# Altium schematic sheet SI5324_CDR_DCXO_oscillators.SchDoc: Metlino
size 420 x 297 mm; CheckedBy: P.Kulik,T.Przywozki,W.Ruclo; Author: G.Kasprowicz; CompanyName: WUT ISE; DrawnBy: G.Kasprowicz; Organization: WUT ISE; Address1: PW ISE; Address2: Nowowiejska 15/19 00-665 Warsaw; Address3: gkasprow@gmail.com; DocumentNumber: 12; Revision: 2; SheetNumber: 12; SheetTotal: 29; ModifiedBy: -; CheckedDate: -; Title2: Si5324 & DCXO clocks; DivGrp: WUT ISE; Designer: G.Kasprowicz; ModifiedDate: -; ProjectName: Sensor Box
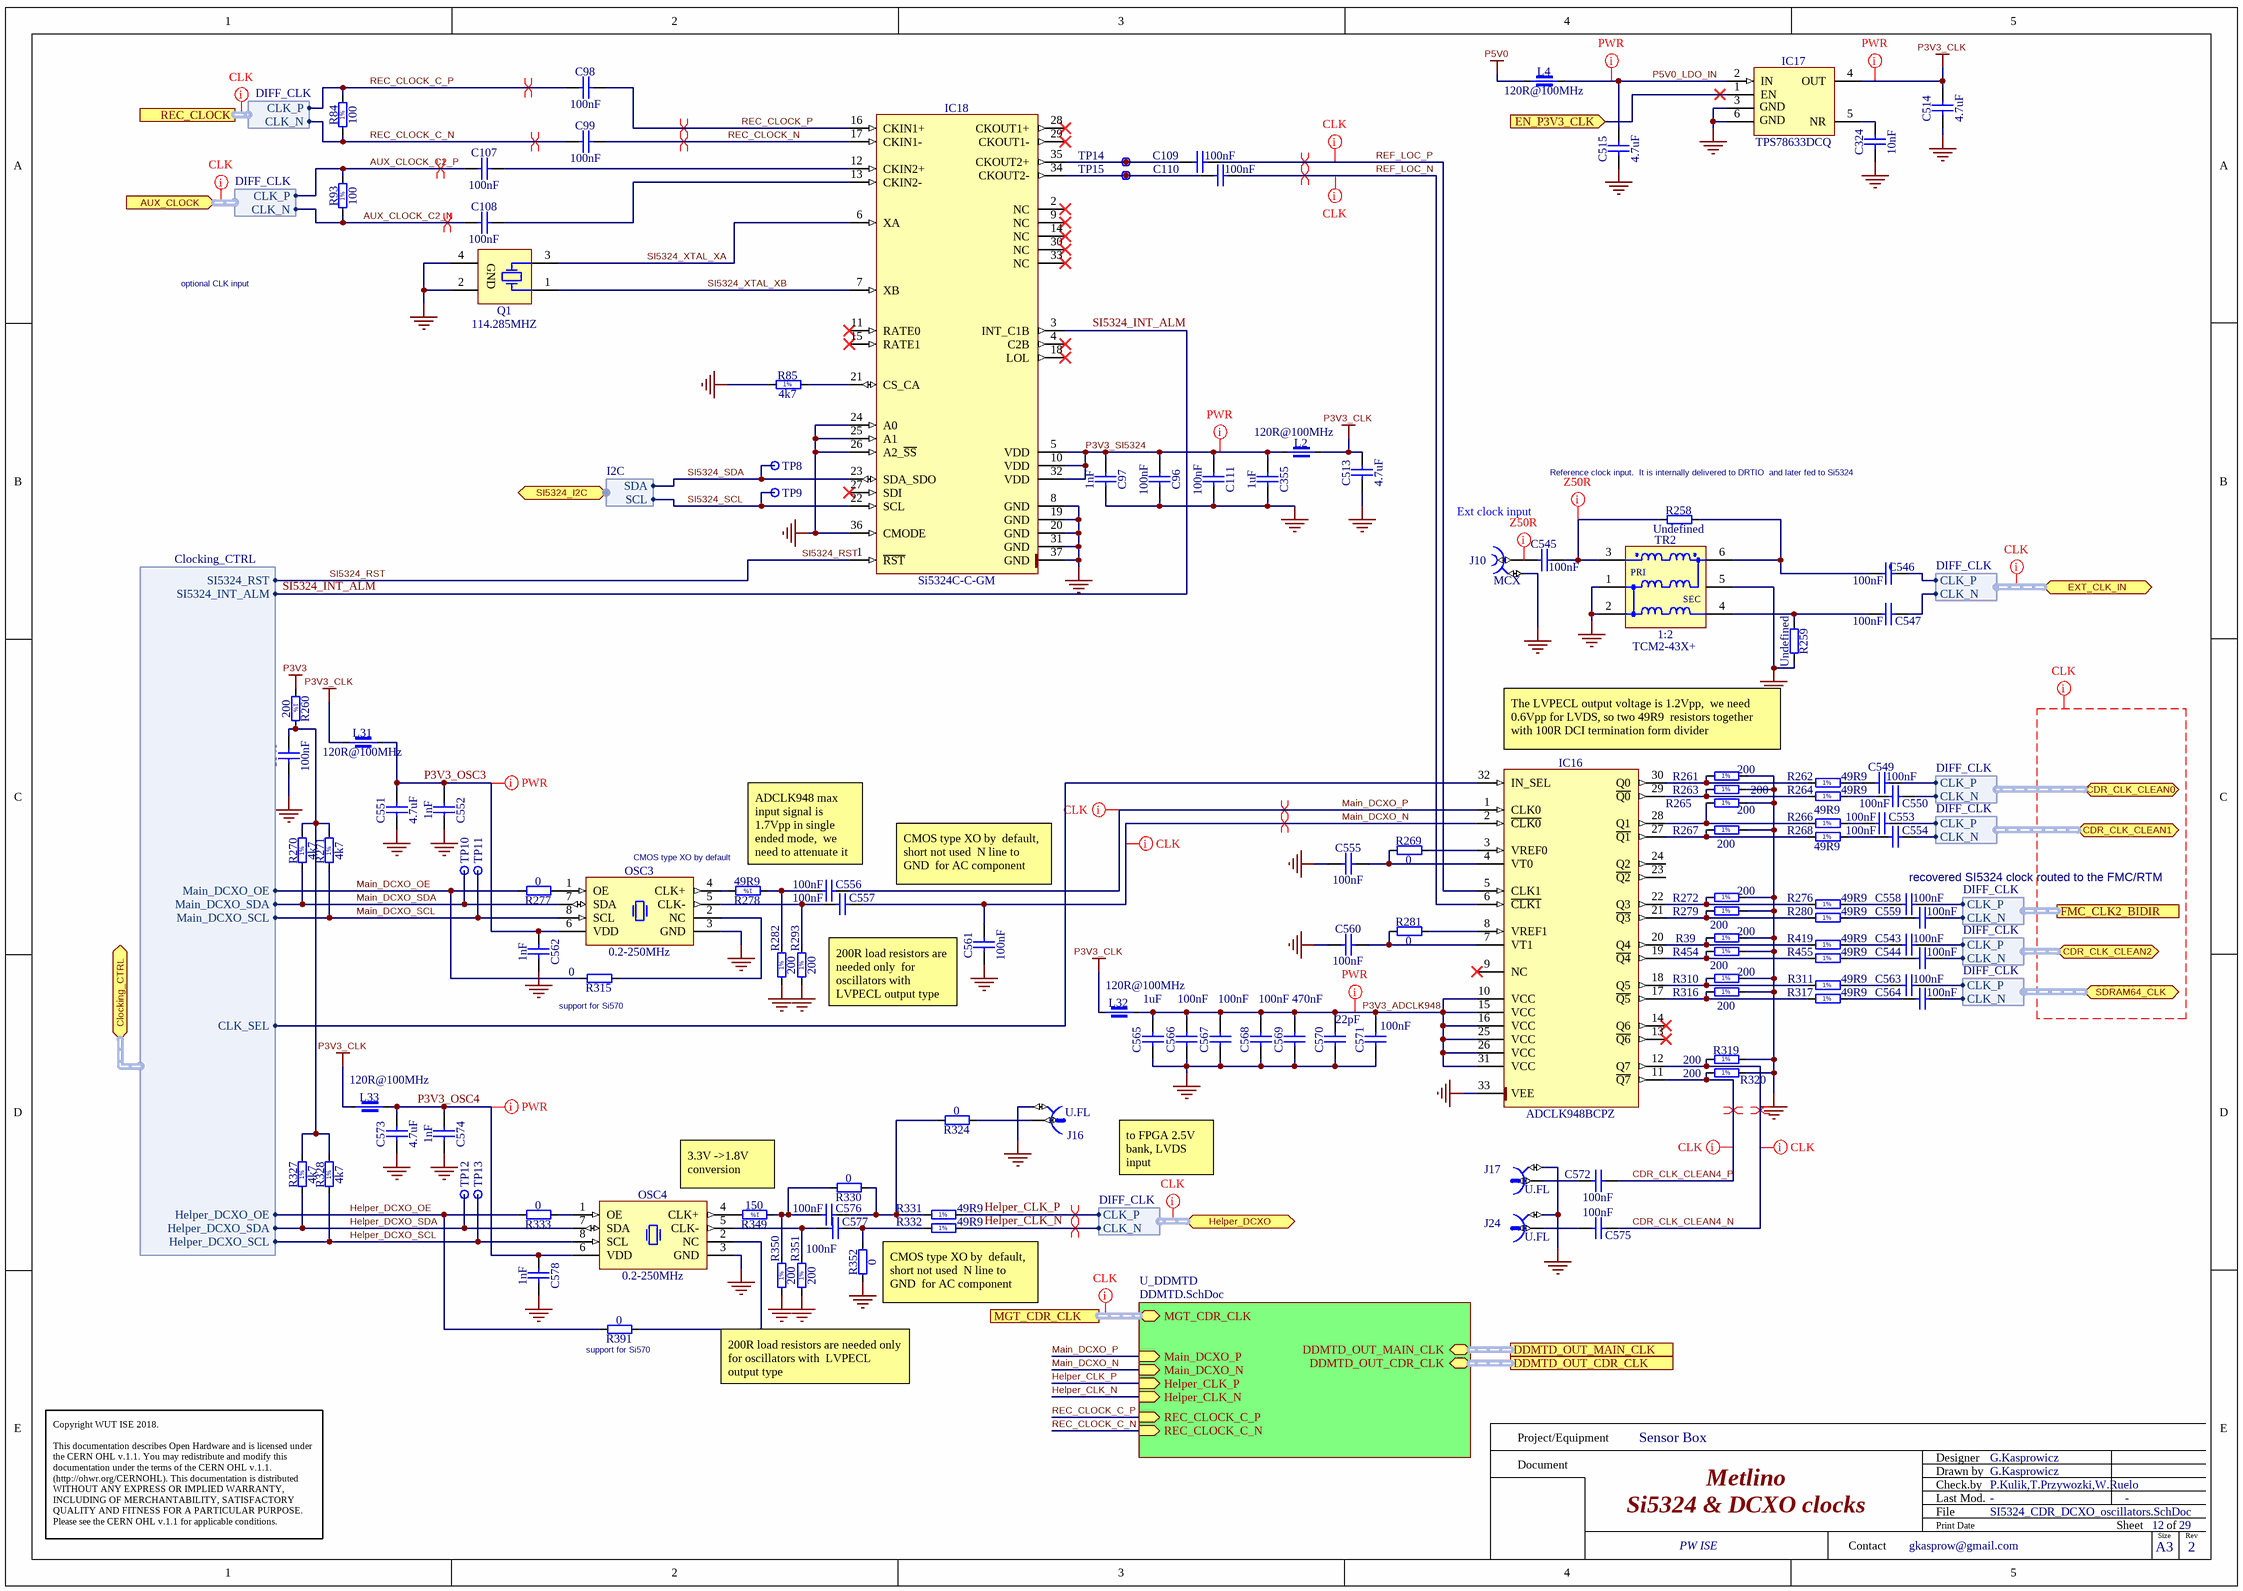
[diagram p0: SI5324_CDR_DCXO_oscillators.SchDoc]

## Parts
C96  100nF  [CAPC0603X33N]
C97  1nF  [CAPC0603X33N]
C98  100nF  [CAPC0603X33N]
C99  100nF  [CAPC0603X33N]
C107  100nF  [CAPC0603X33N]
C108  100nF  [CAPC0603X33N]
C109  100nF  [CAPC1005X55N]
C110  100nF  [CAPC1005X55N]
C111  100nF  [CAPC0603X33N]
C324  10nF  [CAPC1608X87N]
C355  1uF  [CAPC1005X55N]
C513  4.7uF  [CAPC1608X90N]
C514  4.7uF  [CAPC1608X90N]
C515  4.7uF  [CAPC1608X90N]
C543  100nF  [CAPC0603X33N]
C544  100nF  [CAPC0603X33N]
C545  100nF  [CAPC1005X55N]
C546  100nF  [CAPC1005X55N]
C547  100nF  [CAPC1005X55N]
C548  100nF  [CAPC0603X33N]
C549  100nF  [CAPC0603X33N]
C550  100nF  [CAPC0603X33N]
C551  4.7uF  [CAPC1608X90N]
C552  1nF  [CAPC0603X33N]
C553  100nF  [CAPC0603X33N]
C554  100nF  [CAPC0603X33N]
C555  100nF  [CAPC0603X33N]
C556  100nF  [CAPC1005X55N]
C557  100nF  [CAPC1005X55N]
C558  100nF  [CAPC0603X33N]
C559  100nF  [CAPC0603X33N]
C560  100nF  [CAPC0603X33N]
C561  100nF  [CAPC0603X33N]
C562  1nF  [CAPC0603X33N]
C563  100nF  [CAPC0603X33N]
C564  100nF  [CAPC0603X33N]
C565  1uF  [CAPC1005X55N]
C566  100nF  [CAPC0603X33N]
C567  100nF  [CAPC0603X33N]
C568  100nF  [CAPC0603X33N]
C569  470nF  [CAPC1005X55N]
C570  22pF  [CAPC1005X55N]
C571  100nF  [CAPC0603X33N]
C572  100nF  [CAPC0603X33N]
C573  4.7uF  [CAPC1608X90N]
C574  1nF  [CAPC0603X33N]
C575  100nF  [CAPC0603X33N]
C576  100nF  [CAPC1005X55N]
C577  100nF  [CAPC1005X55N]
C578  1nF  [CAPC0603X33N]
IC16  ADCLK948BCPZ  [QFN50P500X500X80-33N-S285]
IC17  TPS78633DCQ  [SOT127P700X180-6N]
IC18  Si5324C-C-GM  [QFN50P600X600X90-37N-S425]
J10  MCX  [AMPHENOL_ARF2521-ND]
J16  U.FL  [HIROSE_U.FL-R-SMT-1(10)]
J17  U.FL  [HIROSE_U.FL-R-SMT-1(10)]
J24  U.FL  [HIROSE_U.FL-R-SMT-1(10)]
L2  120R@100MHz  [INDC1608X95N]
L4  120R@100MHz  [INDC1608X95N]
L31  120R@100MHz  [INDC1608X95N]
L32  120R@100MHz  [INDC1608X95N]
L33  120R@100MHz  [INDC1608X95N]
OSC3  0.2-250MHz  [OSC_SILICON-LAB_SI549-A]
OSC4  0.2-250MHz  [OSC_SILICON-LAB_SI549-A]
Q1  114.285MHZ  [XTAL_CONNOR_CS]
R39  200  [RESC1005X40N]
R84  100  [RESC1005X40N]
R85  4k7  [RESC1005X40N]
R93  100  [RESC1005X40N]
R258  Undefined  [RESC1005X40N]
R259  Undefined  [RESC1005X40N]
R260  200  [RESC1005X40N]
R261  200  [RESC1005X40N]
R262  49R9  [RESC1005X40N]
R263  200  [RESC1005X40N]
R264  49R9  [RESC1005X40N]
R265  200  [RESC1005X40N]
R266  49R9  [RESC1005X40N]
R267  200  [RESC1005X40N]
R268  49R9  [RESC1005X40N]
R269  0  [RESC1005X40N]
R270  4k7  [RESC1005X40N]
R271  4k7  [RESC1005X40N]
R272  200  [RESC1005X40N]
R276  49R9  [RESC1005X40N]
R277  0  [RESC1005X40N]
R278  49R9  [RESC1005X40N]
R279  200  [RESC1005X40N]
R280  49R9  [RESC1005X40N]
R281  0  [RESC1005X40N]
R282  200  [RESC1005X40N]
R293  200  [RESC1005X40N]
R310  200  [RESC1005X40N]
R311  49R9  [RESC1005X40N]
R315  0  [RESC1005X40N]
R316  200  [RESC1005X40N]
R317  49R9  [RESC1005X40N]
R319  200  [RESC1005X40N]
R320  200  [RESC1005X40N]
R324  0  [RESC1005X40N]
R327  4k7  [RESC1005X40N]
R328  4k7  [RESC1005X40N]
R330  0  [RESC1005X40N]
R331  49R9  [RESC1005X40N]
R332  49R9  [RESC1005X40N]
R333  0  [RESC1005X40N]
R349  150  [RESC1005X40N]
R350  200  [RESC1005X40N]
R351  200  [RESC1005X40N]
R352  0  [RESC1005X40N]
R391  0  [RESC1005X40N]
R419  49R9  [RESC1005X40N]
R454  200  [RESC1005X40N]
R455  49R9  [RESC1005X40N]
TP8  Test Point  [TPS127]  (value not drawn)
TP9  Test Point  [TPS127]  (value not drawn)
TP10  Test Point  [TPS127]  (value not drawn)
TP11  Test Point  [TPS127]  (value not drawn)
TP12  Test Point  [TPS127]  (value not drawn)
TP13  Test Point  [TPS127]  (value not drawn)
TP14  Test Point  [TPS127]  (value not drawn)
TP15  Test Point  [TPS127]  (value not drawn)
TR2  1:2  Manufacturer Part Number: TCM2-43X+  [XFMR_MINI-CIRCUITS_DB1627]

## Sub-sheets
U_DDMTD = DDMTD.SchDoc: MGT_CDR_CLK (bidir, harness DIFF_CLK), DDMTD_OUT_CDR_CLK (bidir, harness DIFF_CLK), DDMTD_OUT_MAIN_CLK (bidir, harness DIFF_CLK), Main_DCXO_P (in), Main_DCXO_N (in), Helper_CLK_P (in), Helper_CLK_N (in), REC_CLOCK_C_P (in), REC_CLOCK_C_N (in)

## Ports
AUX_CLOCK (in, harness DIFF_CLK), CDR_CLK_CLEAN0 (bidir, harness DIFF_CLK), CDR_CLK_CLEAN1 (bidir, harness DIFF_CLK), CDR_CLK_CLEAN2 (bidir, harness DIFF_CLK), Clocking_CTRL (bidir, harness Clocking_CTRL), DDMTD_OUT_CDR_CLK (harness DIFF_CLK), DDMTD_OUT_MAIN_CLK (harness DIFF_CLK), EN_P3V3_CLK (in), EXT_CLK_IN (bidir, harness DIFF_CLK), FMC_CLK2_BIDIR (harness DIFF_CLK), Helper_DCXO (bidir, harness DIFF_CLK), MGT_CDR_CLK (harness DIFF_CLK), REC_CLOCK (harness DIFF_CLK), SDRAM64_CLK (bidir, harness DIFF_CLK), SI5324_I2C (bidir, harness I2C)

## Harnesses
I2C: SCL, SDA
DIFF_CLK: CLK_N, CLK_P
Clocking_CTRL: Main_DCXO_OE, Main_DCXO_SDA, Main_DCXO_SCL, Helper_DCXO_OE, Helper_DCXO_SDA, Helper_DCXO_SCL, CLK_SEL, SI5324_RST, SI5324_INT_ALM

## Nets
GND: C96.1 C97.1 C111.1 C324.1 C355.2 C513.1 C514.1 C515.1 C548.1 C551.1 C552.1 C555.1 C560.1 C561.1 C562.1 C565.2 C566.1 C567.1 C568.1 C569.1 C570.1 C571.1 C573.1 C574.1 C578.1 IC16.33(VEE) IC17.3(GND) IC17.6(GND) IC18.8(GND) IC18.19(GND) IC18.20(GND) IC18.24(A0) IC18.25(A1) IC18.26(A2_~{SS}) IC18.31(GND) IC18.36(CMODE) IC18.37(GND) J10.2 J16.2 J17.2 J24.2 OSC3.3(GND) OSC4.3(GND) Q1.2(GND) Q1.4(GND) R39.2 R85.1 R259.1 R261.2 R263.2 R265.2 R267.2 R272.2 R279.2 R282.1 R293.1 R310.2 R316.2 R319.2 R320.2 R350.1 R351.1 R352.1 R454.2 TR2.1(P1) TR2.2(P1) TR2.5(NC)
P3V3: R260.1
P3V3_CLK: C513.2 C514.2 IC17.4(OUT) L2.1 L31.1 L32.1 L33.1
P5V0: L4.1
AUX_CLOCK_C2_N: C108.2 R93.1 ; port AUX_CLOCK.CLK_N
AUX_CLOCK_C2_P: C107.2 R93.2 ; port AUX_CLOCK.CLK_P
CDR_CLK_CLEAN4_N: C575.1 IC16.12(Q7) R319.1
CDR_CLK_CLEAN4_P: C572.2 IC16.11(~{Q7}) R320.1
EN_P3V3_CLK: IC17.1(EN) ; port EN_P3V3_CLK
Helper_CLK_N: R332.2 ; sheet U_DDMTD/Helper_CLK_N, port Helper_DCXO.CLK_N
Helper_CLK_P: R331.2 ; sheet U_DDMTD/Helper_CLK_P, port Helper_DCXO.CLK_P
Helper_DCXO_OE: R333.2 R391.2 ; port Clocking_CTRL.Helper_DCXO_OE
Helper_DCXO_SCL: OSC4.8(SCL) R328.1 TP13.1 ; port Clocking_CTRL.Helper_DCXO_SCL
Helper_DCXO_SDA: OSC4.7(SDA) R327.1 TP12.1 ; port Clocking_CTRL.Helper_DCXO_SDA
Main_DCXO_N: C557.2 C561.2 IC16.2(~{CLK0}) ; sheet U_DDMTD/Main_DCXO_N
Main_DCXO_OE: R277.2 R315.2 ; port Clocking_CTRL.Main_DCXO_OE
Main_DCXO_P: C556.2 IC16.1(CLK0) ; sheet U_DDMTD/Main_DCXO_P
Main_DCXO_SCL: OSC3.8(SCL) R271.1 TP11.1 ; port Clocking_CTRL.Main_DCXO_SCL
Main_DCXO_SDA: OSC3.7(SDA) R270.1 TP10.1 ; port Clocking_CTRL.Main_DCXO_SDA
P3V3_ADCLK948: C565.1 C566.2 C567.2 C568.2 C569.2 C570.2 C571.2 IC16.10(VCC) IC16.15(VCC) IC16.16(VCC) IC16.25(VCC) IC16.26(VCC) IC16.31(VCC) L32.2
P3V3_OSC3: C551.2 C552.2 C562.2 L31.2 OSC3.6(VDD)
P3V3_OSC4: C573.2 C574.2 C578.2 L33.2 OSC4.6(VDD)
P3V3_SI5324: C96.2 C97.2 C111.2 C355.1 IC18.5(VDD) IC18.10(VDD) IC18.32(VDD) L2.2
P5V0_LDO_IN: C515.2 IC17.2(IN) L4.2
REC_CLOCK_C_N: C99.2 R84.1 ; sheet U_DDMTD/REC_CLOCK_C_N, port REC_CLOCK.CLK_N
REC_CLOCK_C_P: C98.2 R84.2 ; sheet U_DDMTD/REC_CLOCK_C_P, port REC_CLOCK.CLK_P
REC_CLOCK_N: C99.1 IC18.17(CKIN1-)
REC_CLOCK_P: C98.1 IC18.16(CKIN1+)
REF_LOC_N: C110.2 IC16.6(~{CLK1})
REF_LOC_P: C109.2 IC16.5(CLK1)
SI5324_INT_ALM: IC18.3(INT_C1B) ; port Clocking_CTRL.SI5324_INT_ALM
SI5324_RST: IC18.1(~{RST}) ; port Clocking_CTRL.SI5324_RST
SI5324_SCL: IC18.22(SCL) TP9.1 ; port SI5324_I2C.SCL
SI5324_SDA: IC18.23(SDA_SDO) TP8.1 ; port SI5324_I2C.SDA
SI5324_XTAL_XA: IC18.6(XA) Q1.3(X)
SI5324_XTAL_XB: IC18.7(XB) Q1.1(X)
NetC107_1: C107.1 IC18.12(CKIN2+)
NetC108_1: C108.1 IC18.13(CKIN2-)
NetC109_1: C109.1 IC18.35(CKOUT2+) TP14.1
NetC110_1: C110.1 IC18.34(CKOUT2-) TP15.1
NetC324_2: C324.2 IC17.5(NR)
NetC543_1: C543.1 R419.2
NetC543_2: C543.2 ; port CDR_CLK_CLEAN2.CLK_P
NetC544_1: C544.1 R455.2
NetC544_2: C544.2 ; port CDR_CLK_CLEAN2.CLK_N
NetC545_1: C545.1 J10.1
NetC545_2: C545.2 R258.2 TR2.3(P1)
NetC546_1: C546.1 R258.1 TR2.6(S1)
NetC546_2: C546.2 ; port EXT_CLK_IN.CLK_P
NetC547_1: C547.1 R259.2 TR2.4(S1)
NetC547_2: C547.2 ; port EXT_CLK_IN.CLK_N
NetC548_2: C548.2 R260.2 R270.2 R271.2 R327.2 R328.2
NetC549_1: C549.1 R262.2
NetC549_2: C549.2 ; port CDR_CLK_CLEAN0.CLK_P
NetC550_1: C550.1 R264.2
NetC550_2: C550.2 ; port CDR_CLK_CLEAN0.CLK_N
NetC553_1: C553.1 R266.2
NetC553_2: C553.2 ; port CDR_CLK_CLEAN1.CLK_P
NetC554_1: C554.1 R268.2
NetC554_2: C554.2 ; port CDR_CLK_CLEAN1.CLK_N
NetC555_2: C555.2 IC16.4(VT0) R269.1
NetC556_1: C556.1 R278.1 R282.2
NetC557_1: C557.1 OSC3.5(CLK-) R293.2
NetC558_1: C558.1 R276.2
NetC558_2: C558.2 ; port FMC_CLK2_BIDIR.CLK_P
NetC559_1: C559.1 R280.2
NetC559_2: C559.2 ; port FMC_CLK2_BIDIR.CLK_N
NetC560_2: C560.2 IC16.7(VT1) R281.1
NetC563_1: C563.1 R311.2
NetC563_2: C563.2 ; port SDRAM64_CLK.CLK_P
NetC564_1: C564.1 R317.2
NetC564_2: C564.2 ; port SDRAM64_CLK.CLK_N
NetC572_1: C572.1 J17.1
NetC575_2: C575.2 J24.1
NetC576_1: C576.1 R330.2 R349.1 R350.2
NetC576_2: C576.2 R324.2 R330.1 R331.1
NetC577_1: C577.1 OSC4.5(CLK-) R351.2
NetC577_2: C577.2 R332.1 R352.2
NetIC16_3: IC16.3(VREF0) R269.2
NetIC16_8: IC16.8(VREF1) R281.2
NetIC16_17: IC16.17(~{Q5}) R316.1 R317.1
NetIC16_18: IC16.18(Q5) R310.1 R311.1
NetIC16_19: IC16.19(~{Q4}) R454.1 R455.1
NetIC16_20: IC16.20(Q4) R39.1 R419.1
NetIC16_21: IC16.21(~{Q3}) R279.1 R280.1
NetIC16_22: IC16.22(Q3) R272.1 R276.1
NetIC16_27: IC16.27(~{Q1}) R267.1 R268.1
NetIC16_28: IC16.28(Q1) R265.1 R266.1
NetIC16_29: IC16.29(~{Q0}) R263.1 R264.1
NetIC16_30: IC16.30(Q0) R261.1 R262.1
NetIC16_32: IC16.32(IN_SEL) ; port Clocking_CTRL.CLK_SEL
NetIC18_21: IC18.21(CS_CA) R85.2
NetJ16_1: J16.1 R324.1
NetOSC3_1: OSC3.1(OE) R277.1
NetOSC3_2: OSC3.2(NC) R315.1
NetOSC3_4: OSC3.4(CLK+) R278.2
NetOSC4_1: OSC4.1(OE) R333.1
NetOSC4_2: OSC4.2(NC) R391.1
NetOSC4_4: OSC4.4(CLK+) R349.2

Not connected (* = marked no-connect by the designer): IC16 9(NC)* 13(~{Q6})* 14(Q6)* 23(~{Q2}) 24(Q2); IC18 2(NC)* 4(C2B)* 9(NC)* 11(RATE0)* 14(NC)* 15(RATE1)* 18(LOL)* 27(SDI)* 28(CKOUT1+)* 29(CKOUT1-)* 30(NC)* 33(NC)*

## Buses and harness runs
harness port DDMTD_OUT_CDR_CLK = sheet U_DDMTD/DDMTD_OUT_CDR_CLK
harness port DDMTD_OUT_MAIN_CLK = sheet U_DDMTD/DDMTD_OUT_MAIN_CLK
harness port MGT_CDR_CLK = sheet U_DDMTD/MGT_CDR_CLK

## Layout directives
net class PWR: P3V3_ADCLK948, P3V3_CLK, P3V3_OSC3, P3V3_OSC4, P3V3_SI5324, P5V0_LDO_IN
differential pair: AUX_CLOCK_C2_N, AUX_CLOCK_C2_P, CDR_CLK_CLEAN4_N, CDR_CLK_CLEAN4_P, Helper_CLK_N, Helper_CLK_P, Main_DCXO_N, Main_DCXO_P, REC_CLOCK_C_N, REC_CLOCK_C_P, REC_CLOCK_N, REC_CLOCK_P, REF_LOC_N, REF_LOC_P
net class CLK: (no net found under the mark), CDR_CLK_CLEAN4_N, CDR_CLK_CLEAN4_P, Main_DCXO_N, Main_DCXO_P, REF_LOC_N, REF_LOC_P
net class Z50R: NetC545_1, NetC545_2

## Notes on the sheet
- optional CLK input
- Ext clock input
- (near R258) Reference clock input.  It is internally delivered to DRTIO  and later fed to Si5324
- The LVPECL output voltage is 1.2Vpp,  we need 0.6Vpp for LVDS, so two 49R9  resistors together with 100R DCI termination form divider
- CMOS type XO by default
- ADCLK948 max input signal is 1.7Vpp in single  ended mode,  we need to attenuate it
- CMOS type XO by  default, short not used  N line to GND  for AC component
- recovered SI5324 clock routed to the FMC/RTM
- 200R load resistors are needed only  for oscillators with  LVPECL output type
- (near R315) support for Si570
- 3.3V ->1.8V  conversion
- to FPGA 2.5V bank, LVDS input
- (near R391) support for Si570
- Project/Equipment
- Document
- Designer
- Drawn by
- Check.by
- Copyright WUT ISE 2018.
  This documentation describes Open Hardware and is licensed under the CERN OHL v.1.1. You may redistribute and modify this documentation under the terms of the CERN OHL v.1.1. (http://ohwr.org/CERNOHL). This documentation is distributed WITHOUT ANY EXPRESS OR IMPLIED WARRANTY, INCLUDING OF MERCHANTABILITY, SATISFACTORY QUALITY AND FITNESS FOR A PARTICULAR PURPOSE. Please see the CERN OHL v.1.1 for applicable conditions.
- Contact
- File
- Last Mod.
- Print Date
- Sheet
- Size
- A3
- of
- Rev
- (in symbol R0402_4K7_1%_0.0625W_100PPM) 1%
- (in symbol R0402_49R9_1%_0.0625W_100PPM) 1%
- (in symbol R0402_100R_1%_0.0625W_100PPM) 1%
- (in symbol R0402_150R_1%_0.0625W_100PPM) 1%
- (in symbol R0402_200R_1%_0.0625W_100PPM) 1%
- (in symbol XFMR_MINI-CIRCUITS_TCM2-43X+) PRI; SEC

## Library data of the parts
C96 C98 C99 C107 C108 C111 C543 C544 C548-C550 C553-C555 C558-C561 C563 C564 C566-C568 C571 C572 C575 = CC0201_100NF_6.3V_10%_X5R: Non-polarised capacitor; Manufacturer: GENERIC; Part Description: SMD Multilayer Chip Ceramic Capacitor; Manufacturer1 Part Number: 02016D104KAT2A; Tolerance: ±10%; Voltage: 6.3V; TC: X5R; Manufacturer Part Number: CC0201_100NF_6.3V_10%_X5R; Part Number: CC0201_100NF_6.3V_10%_X5R; Value: 100nF; Component Kind: Standard; Component Type: Standard; Pin Count: 2; Status: Not Recommended; Case: 0201; Mounted: Yes; Socket: No; SMD: Yes; Sense: No; Manufacturer1 Example: AVX; Manufacturer1 ComponentHeight: 0.33mm; HelpURL: \\cern.ch\dfs\Applications\Altium\Datasheets\CC0201_X5R_AVX.pdf; Author: CERN DEM JLC; CreateDate: 03.12.2007; LatestRevisionDate: 03.12.2007
C97 C552 C562 C574 C578 = CC0201_1NF_16V_10%_X5R: Non-polarised capacitor; Manufacturer: GENERIC; Part Description: SMD Multilayer Chip Ceramic Capacitor; Manufacturer1 Part Number: 0201YD102KAT2A; Tolerance: ±10%; Voltage: 16V; TC: X5R; Manufacturer Part Number: CC0201_1NF_16V_10%_X5R; Part Number: CC0201_1NF_16V_10%_X5R; Value: 1nF; Component Kind: Standard; Component Type: Standard; Pin Count: 2; Status: Not Recommended; Case: 0201; Mounted: Yes; Socket: No; SMD: Yes; Sense: No; Manufacturer1 Example: AVX; Manufacturer1 ComponentHeight: 0.33mm; HelpURL: \\cern.ch\dfs\Applications\Altium\Datasheets\CC0201_X5R_AVX.pdf; Author: CERN DEM JLC; CreateDate: 03.12.2007; LatestRevisionDate: 03.12.2007
C109 C110 C545-C547 C556 C557 C576 C577 = CC0402_100NF_16V_10%_X5R: Non-polarised capacitor; Manufacturer: GENERIC; Manufacturer1 Part Number: GRM155R61C104KA88D; Part Description: SMD Multilayer Chip Ceramic Capacitor; TC: X5R; Tolerance: ±10%; Voltage: 16V; Case: 0402; Manufacturer Part Number: CC0402_100NF_16V_10%_X5R; Manufacturer1 Example: MURATA; Part Number: CC0402_100NF_16V_10%_X5R; Pin Count: 2; SMD: Yes; Status: None; Value: 100nF; Component Kind: Standard; Component Type: Standard; Mounted: Yes; Socket: No; Sense: No; Manufacturer1 ComponentHeight: 0.55mm; HelpURL: \\cern.ch\dfs\Applications\Altium\Datasheets\CC0402_X5R_MURATA_GRM.pdf; Author: CERN DEM JLC; CreateDate: 10.12.2013; LatestRevisionDate: 10.12.2013
C324 = CC0603_10NF_50V_5%_C0G: Non-polarised capacitor; Part Description: SMD Multilayer Chip Ceramic Capacitor; Manufacturer: GENERIC; Manufacturer1 Part Number: C1608C0G1H103J080AA; Voltage: 50V; TC: C0G/NP0; Tolerance: ±5%; Part Number: CC0603_10NF_50V_5%_C0G; Component Kind: Standard; Component Type: Standard; Pin Count: 2; Value: 10nF; Status: Preferred; Manufacturer Part Number: CC0603_10NF_50V_5%_C0G; Case: 0603; Mounted: Yes; Socket: No; SMD: Yes; Sense: No; Manufacturer1 Example: TDK; Manufacturer1 ComponentHeight: 0.9mm; HelpURL: \\cern.ch\dfs\Applications\Altium\Datasheets\CC0603_C0G_TDK_C.pdf; Author: CERN DEM JLC; CreateDate: 10.12.2014; LatestRevisionDate: 10.12.2014
C355 C565 = CC0402_1UF_16V_10%_X5R: Non-polarised capacitor; Manufacturer: GENERIC; Part Description: SMD Multilayer Chip Ceramic Capacitor; Manufacturer1 Part Number: C1005X5R1C105KT; Tolerance: ±10%; Voltage: 16V; TC: X5R; Manufacturer Part Number: CC0402_1UF_16V_10%_X5R; Part Number: CC0402_1UF_16V_10%_X5R; Value: 1uF; Component Kind: Standard; Component Type: Standard; Pin Count: 2; Status: Preferred; Case: 0402; Mounted: Yes; Socket: No; SMD: Yes; Sense: No; Manufacturer1 Example: TDK; Manufacturer1 ComponentHeight: 0.55mm; HelpURL: \\cern.ch\dfs\Applications\Altium\Datasheets\CC0402_X5R_TDK_C.pdf; Author: CERN DEM JLC; CreateDate: 25.10.2012; LatestRevisionDate: 25.10.2012
C513-C515 C551 C573 = CC0603_4.7UF_25V_10%_X5R: Non-polarised capacitor; Manufacturer: GENERIC; Part Description: SMD Multilayer Chip Ceramic Capacitor; Manufacturer1 Part Number: GRM188R61E475KE11D; Tolerance: ±10%; Voltage: 25V; TC: X5R; Manufacturer Part Number: CC0603_4.7UF_25V_10%_X5R; Part Number: CC0603_4.7UF_25V_10%_X5R; Value: 4.7uF; Component Kind: Standard; Component Type: Standard; Pin Count: 2; Status: None; Case: 0603; Mounted: Yes; Socket: No; SMD: Yes; Sense: No; Manufacturer1 Example: MURATA; Manufacturer1 ComponentHeight: 0.95mm; HelpURL: \\cern.ch\dfs\Applications\Altium\Datasheets\CC0603_MURATA_GRM188R61E475KE11D.pdf; Author: CERN DEM JLC; CreateDate: 10.11.2014; LatestRevisionDate: 10.11.2014
C569 = CC0402_470NF_16V_10%_X5R: Non-polarised capacitor; Manufacturer: GENERIC; Part Description: SMD Multilayer Chip Ceramic Capacitor; Manufacturer1 Part Number: C1005X5R1C105KT; Tolerance: ±10%; Voltage: 16V; TC: X5R; Manufacturer Part Number: CC0402_470NF_16V_10%_X5R; Part Number: CC0402_470NF_16V_10%_X5R; Value: 470nF; Component Kind: Standard; Component Type: Standard; Pin Count: 2; Status: Preferred; Case: 0402; Mounted: Yes; Socket: No; SMD: Yes; Sense: No; Manufacturer1 Example: TDK; Manufacturer1 ComponentHeight: 0.55mm; HelpURL: \\cern.ch\dfs\Applications\Altium\Datasheets\CC0402_X5R_TDK_C.pdf; Author: CERN DEM JLC; CreateDate: 25.10.2012; LatestRevisionDate: 25.10.2012
C570 = CC0402_22PF_50V_5%_C0G: Non-polarised capacitor; Manufacturer: GENERIC; Part Description: SMD Multilayer Chip Ceramic Capacitor; Manufacturer1 Part Number: C0402C220J5GACTU; Tolerance: ±5%; Voltage: 50V; TC: C0G/NP0; Manufacturer Part Number: CC0402_22PF_50V_5%_C0G; Part Number: CC0402_22PF_50V_5%_C0G; Value: 22pF; Component Kind: Standard; Component Type: Standard; Pin Count: 2; Status: Preferred; Case: 0402; Mounted: Yes; Socket: No; SMD: Yes; Sense: No; Manufacturer1 Example: KEMET; Manufacturer1 ComponentHeight: 0.55mm; HelpURL: \\cern.ch\dfs\Applications\Altium\Datasheets\CC0805_C0G_KEMET_(Commercial Grade).pdf; Author: CERN DEM JLC; CreateDate: 03.12.2007; LatestRevisionDate: 03.12.2007
IC16 = ADCLK948BCPZ: Two Selectable Inputs, 8 LVPECL Outputs, SiGe Clock Fanout Buffer; Manufacturer: ANALOG DEVICES; PressFit: No; Bonding: No; Manufacturer Part Number: ADCLK948BCPZ; Part Description: Two Selectable Inputs, 8 LVPECL Outputs, SiGe Clock Fanout Buffer; Part Number: ADCLK948BCPZ; Component Kind: Standard; Component Type: Standard; Device: ADCLK948BCPZ; PackageDescription: QFN, 0.50mm Pitch, Square; 8 Pin X 8 Pin, 5mm X 5mm X 1.00mm H body (w/thermal tab 2.85 X 2.85mm),  IPC Medium Density; Pin Count: 33; Case: QFN32; Mounted: Yes; Socket: No; SMD: Yes; Sense: No; ComponentHeight: 0.8mm; Author: CERN DEM MR; HelpURL: \\cern.ch\dfs\Applications\Altium\Datasheets\ADCLK948BCPZ.pdf; CreateDate: 30.11.2016; LatestRevisionDate: 30.11.2016
IC17 = TPS78633DCQ: Ultralow-Noise, High-PSRR, Fast, RF, 1.5A Low-Dropout Linear Regulator; Part Description: 3.3V Ultralow-Noise, High-PSRR, Fast, RF, 1.5A Low-Dropout Linear Regulator; Manufacturer: TEXAS INSTRUMENTS; PressFit: No; Bonding: No; Part Number: TPS78633DCQ; Component Kind: Standard; Component Type: Standard; Device: TPS78633DCQ; PackageDescription: SOT223, 6-Leads, Body 6.6x7.3mm (max), Pitch 1.27mm, IPC Medium Density; Manufacturer Part Number: TPS78633DCQ; Pin Count: 6; Case: SOT223; Mounted: Yes; Socket: No; SMD: Yes; Sense: No; ComponentHeight: 1.8mm; HelpURL: \\cern.ch\dfs\Applications\Altium\Datasheets\TPS78633DCQ.pdf; Author: CERN DEM JMW; CreateDate: 07.10.2008; LatestRevisionDate: 13.02.2017
IC18 = Si5324C-C-GM: Any Frequency Precision Clock Multiplier/Jitter Attenuator; Manufacturer: SILICON LABS; PressFit: No; Bonding: No; Manufacturer Part Number: Si5324C-C-GM; PackageDescription: QFN, 0.50mm Pitch, Square; 36 Pin, 6.00mm L X 6.00mm W X 0.90mm H Body (w/thermal tab 4.25mm x 4.25mm), IPC Medium Density; Part Description: Any Frequency Precision Clock Multiplier/Jitter Attenuator; Part Number: Si5324C-C-GM; Component Kind: Standard; Component Type: Standard; Device: Si5324C-C-GM; Pin Count: 37; Case: QFN36; Mounted: Yes; Socket: No; SMD: Yes; Sense: No; ComponentHeight: 0.9mm; HelpURL: \\cern.ch\dfs\Applications\Altium\Datasheets\Si5324C-C-GM.pdf; Author: CERN DEM JLC; CreateDate: 19.08.2013; LatestRevisionDate: 19.08.2013
J10 = CON_MCX: Part Description: 50 Ohms MCX Right Angle PCB Receptacle (Jack); Manufacturer: AMPHENOL; PressFit: No; Part Number: AMPHENOL_ARF2521-ND; Component Kind: Standard; Component Type: Standard; Pin Count: 2; Family: MCX; Mounted: Yes; Socket: No; SMD: No; Sense: No; Status: None; Manufacturer Part Number: AMPHENOL_ARF2521-ND; ComponentHeight: 6; HelpURL: \\cern.ch\dfs\Applications\Altium\Datasheets\AMPHENOL_34-1030-12G.pdf; Author: GK; CreateDate: 21.02.2017; LatestRevisionDate: 21.02.2017
J16 J17 J24 = HIROSE_U.FL-R-SMT-1(10): Manufacturer: HIROSE (HRS); Part Description: Up to 6GHz Ultra Small Surface Mount Male Coaxial Connectors U.FL Series; PressFit: No; Manufacturer Part Number: U.FL-R-SMT-1(10); Part Number: HIROSE_U.FL-R-SMT-1(10); Component Kind: Standard; Component Type: Standard; Pin Count: 2; Family: U.FL; Mounted: Yes; Socket: No; SMD: Yes; Sense: No; Status: None; ComponentHeight: 1.25mm; HelpURL: \\cern.ch\dfs\Applications\Altium\Datasheets\HIROSE_U.FL-R-SMT-1(10).pdf; Author: CERN DEM JLC; CreateDate: 24.03.2010; LatestRevisionDate: 24.03.2010
L2 L4 L31-L33 = IND0603_MURATA_BLM18PG121SN1D: Manufacturer: MURATA; Part Description: SMD EMIFIL Chip Ferrite Bead; Power: 2A; Resistance: 0.05R; Manufacturer Part Number: BLM18PG121SN1D; Part Number: IND0603_MURATA_BLM18PG121SN1D; Value: 120R@100MHz; Component Kind: Standard; Component Type: Standard; Pin Count: 2; Status: None; Case: 0603; Mounted: Yes; Socket: No; SMD: Yes; Sense: No; ComponentHeight: 0.95mm; HelpURL: \\cern.ch\dfs\Applications\Altium\Datasheets\IND0603_MURATA_BLM18P.pdf; Author: CERN DEM BC; CreateDate: 27.07.2015; LatestRevisionDate: 25.10.2018
OSC3 OSC4 = OSC_0.2-250MHZ_SILICON-LAB_549CBAC000112ABG: Any-Rate I2C Programmable XO Oscillator Si549 Series; Part Description: 0.2-250MHz, 1.8V/2.5V/3.3V ±10ppm CMOS , Any-Rate I2C Programmable XO Oscillator Si549 Series; Manufacturer: SILICON LABS; PressFit: No; Bonding: No; Part Number: OSC_0.2-250MHZ_SILICON-LAB_549CBAC000112ABG; Component Kind: Standard; Component Type: Standard; PackageDescription: Oscillator Si549 Series, 8 pins, 5x7mm; Value: 0.2-250MHz; Manufacturer Part Number: 549CBAC000112ABG; Pin Count: 8; Mounted: Yes; Socket: No; SMD: Yes; Sense: No; ComponentHeight: 1.33mm; HelpURL: \\cern.ch\dfs\Applications\Altium\Datasheets\OSC_SILICON-LAB_SI549.pdf; Author: CERN DEM BC; CreateDate: 25.10.2019; LatestRevisionDate: 25.10.2019
Q1 = XTAL_114.285MHZ_CONNOR_CS-023: Crystal 4 pins 1=XTAL Control 2=GND3=XTAL 4=GND; Manufacturer Part Number: CS-023-114.285M; Manufacturer: CONNOR-WINFIELD; Part Description: ±20ppm 18pF -40°C to +85°C  4 Pins, 3.2x2.5X0.8mm, SMD Crystal Unit, CS-018 Series; PressFit: No; Bonding: No; PackageDescription: 4 Pins, 2.5x3.2mm, SMD Sealing Crystal, CS Series; Part Number: XTAL_114.285MHZ_CONNOR_CS-023; Value: 114.285MHZ; Component Kind: Standard; Component Type: Standard; Pin Count: 4; Mounted: Yes; Socket: No; SMD: Yes; Sense: No; ComponentHeight: 0.8mm; HelpURL: \\cern.ch\dfs\Applications\Altium\Datasheets\XTAL_CONNOR_CS-023.pdf; Author: CERN DEM JLC; CreateDate: 08.07.2014; LatestRevisionDate: 08.07.2014
R39 R260 R261 R263 R265 R267 R272 R279 R282 R293 R310 R316 R319 R320 R350 R351 R454 = R0402_200R_1%_0.0625W_100PPM: Resistor - 1%; Manufacturer: GENERIC; Part Description: General Purpose Thick Film Chip Resistor; Manufacturer1 Part Number: 232270672001L; TC: ±100ppm/°C; PressFit: No; Manufacturer Part Number: R0402_200R_1%_0.0625W_100PPM; Part Number: R0402_200R_1%_0.0625W_100PPM; Tolerance: ±1%; Value: 200; Component Kind: Standard; Component Type: Standard; Pin Count: 2; Status: Not Recommended; Power: 0.0625W; Case: 0402; Mounted: Yes; Sense: No; Socket: No; SMD: Yes; Manufacturer1 Example: YAGEO PHYCOMP; Manufacturer1 ComponentHeight: 0.4mm; HelpURL: \\cern.ch\dfs\Applications\Altium\Datasheets\R0402_Phycomp_RC0402.pdf; Author: CERN DEM JLC; CreateDate: 03.12.2007; LatestRevisionDate: 17.10.2012
R84 R93 = R0402_100R_1%_0.0625W_100PPM: Resistor - 1%; Manufacturer: GENERIC; Part Description: General Purpose Thick Film Chip Resistor; Manufacturer1 Part Number: 232270671001L; TC: ±100ppm/°C; PressFit: No; Manufacturer Part Number: R0402_100R_1%_0.0625W_100PPM; Part Number: R0402_100R_1%_0.0625W_100PPM; Tolerance: ±1%; Value: 100; Component Kind: Standard; Component Type: Standard; Pin Count: 2; Status: Not Recommended; Power: 0.0625W; Case: 0402; Mounted: Yes; Sense: No; Socket: No; SMD: Yes; Manufacturer1 Example: YAGEO PHYCOMP; Manufacturer1 ComponentHeight: 0.4mm; HelpURL: \\cern.ch\dfs\Applications\Altium\Datasheets\R0402_Phycomp_RC0402.pdf; Author: CERN DEM JLC; CreateDate: 03.12.2007; LatestRevisionDate: 17.10.2012
R85 R270 R271 R327 R328 = R0402_4K7_1%_0.0625W_100PPM: Resistor - 1%; Manufacturer: GENERIC; Part Description: General Purpose Thick Film Chip Resistor; Manufacturer1 Part Number: 232270674702L; TC: ±100ppm/°C; PressFit: No; Manufacturer Part Number: R0402_4K7_1%_0.0625W_100PPM; Part Number: R0402_4K7_1%_0.0625W_100PPM; Tolerance: ±1%; Value: 4k7; Component Kind: Standard; Component Type: Standard; Pin Count: 2; Status: Not Recommended; Power: 0.0625W; Case: 0402; Mounted: Yes; Sense: No; Socket: No; SMD: Yes; Manufacturer1 Example: YAGEO PHYCOMP; Manufacturer1 ComponentHeight: 0.4mm; HelpURL: \\cern.ch\dfs\Applications\Altium\Datasheets\R0402_Phycomp_RC0402.pdf; Author: CERN DEM JLC; CreateDate: 03.12.2007; LatestRevisionDate: 17.10.2012
R258 R259 = R0402_NO-VALUE: Resistor; Part Description: Reserved Footprint For a 0402 (1005) Chip Resistor; PressFit: No; Mounted: No; Manufacturer Part Number: R0402_NO-VALUE; Manufacturer: Undefined; Part Number: R0402_NO-VALUE; Value: Undefined; Component Kind: Standard; Component Type: Standard; Pin Count: 2; Status: None; Case: 0402; Sense: No; Socket: No; SMD: Yes; Manufacturer1 Example: Undefined; Manufacturer1 Part Number: Undefined; Manufacturer1 ComponentHeight: Undefined; HelpURL: Undefined; Author: CERN DEM JLC; CreateDate: 03.12.2007; LatestRevisionDate: 13.03.2008
R262 R264 R266 R268 R276 R278 R280 R311 R317 R331 R332 R419 R455 = R0402_49R9_1%_0.0625W_100PPM: Resistor - 1%; Manufacturer: GENERIC; Part Description: General Purpose Thick Film Chip Resistor; Manufacturer1 Part Number: 232270674999L or RC0402FR-0749R9L; TC: ±100ppm/°C; PressFit: No; Manufacturer Part Number: R0402_49R9_1%_0.0625W_100PPM; Part Number: R0402_49R9_1%_0.0625W_100PPM; Tolerance: ±1%; Value: 49R9; Component Kind: Standard; Component Type: Standard; Pin Count: 2; Status: Not Recommended; Power: 0.0625W; Case: 0402; Mounted: Yes; Sense: No; Socket: No; SMD: Yes; Manufacturer1 Example: YAGEO PHYCOMP; Manufacturer1 ComponentHeight: 0.4mm; HelpURL: \\cern.ch\dfs\Applications\Altium\Datasheets\R0402_Phycomp_RC0402.pdf; Author: CERN DEM JLC; CreateDate: 24.10.2012; LatestRevisionDate: 24.10.2012
R269 R277 R281 R315 R324 R330 R333 R352 R391 = R0402_0R_JUMPER: Resistor; Manufacturer: GENERIC; Part Description: 1A (0.05R Max DC Resistance) Zero Ohm Jumper; Manufacturer1 Part Number: 232270591001L; PressFit: No; Manufacturer Part Number: R0402_0R_JUMPER; Part Number: R0402_0R_JUMPER; Value: 0; Component Kind: Standard; Component Type: Standard; Pin Count: 2; Status: Not Recommended; Case: 0402; Mounted: Yes; Sense: No; Socket: No; SMD: Yes; Manufacturer1 Example: YAGEO PHYCOMP; Manufacturer1 ComponentHeight: 0.4mm; HelpURL: \\cern.ch\dfs\Applications\Altium\Datasheets\R0402_Phycomp_RC0402.pdf; Author: CERN DEM JLC; CreateDate: 03.12.2007; LatestRevisionDate: 17.10.2012
R349 = R0402_150R_1%_0.0625W_100PPM: Resistor - 1%; Manufacturer: GENERIC; Part Description: General Purpose Thick Film Chip Resistor; Manufacturer1 Part Number: 232270671501L; TC: ±100ppm/°C; PressFit: No; Manufacturer Part Number: R0402_150R_1%_0.0625W_100PPM; Part Number: R0402_150R_1%_0.0625W_100PPM; Tolerance: ±1%; Value: 150; Component Kind: Standard; Component Type: Standard; Pin Count: 2; Status: Not Recommended; Power: 0.0625W; Case: 0402; Mounted: Yes; Sense: No; Socket: No; SMD: Yes; Manufacturer1 Example: YAGEO PHYCOMP; Manufacturer1 ComponentHeight: 0.4mm; HelpURL: \\cern.ch\dfs\Applications\Altium\Datasheets\R0402_Phycomp_RC0402.pdf; Author: CERN DEM JLC; CreateDate: 03.12.2007; LatestRevisionDate: 17.10.2012
TP8-TP15 = SMD_PAD_1.27X1.27MM: Part Description: 1.27mm x 1.27mm PCB Copper Area (SMD Test Point); Mounted: No; Part Number: SMD_PAD_1.27X1.27MM; Component Kind: Standard (No BOM); Component Type: Standard (No BOM); Pin Count: 1; Family: Test Point; Socket: No; SMD: Yes; Sense: No; Status: None; ComponentHeight: 0mm; HelpURL: Undefined; Author: CERN DEM JLC; CreateDate: 12.01.2008; LatestRevisionDate: 12.01.2008; PackageDescription: 1.27mm x 1.27mm PCB Copper Area (SMD Test Point)
TR2 = XFMR_MINI-CIRCUITS_TCM2-43X+: 50 OHMS 10 to 4000 MHz RF Transformer; Power: 0.4W; Part Number: XFMR_MINI-CIRCUITS_TCM2-43X+; Component Kind: Standard; Component Type: Standard; Pin Count: 6; Value: 1:2; Status: None; Part Description: 50 Ohms 10 to 4000MHz RF Transformer; Manufacturer: MINI-CIRCUITS; Mounted: Yes; Socket: No; Sense: No; SMD: Yes; ComponentHeight: 4.06mm; HelpURL: \\cern.ch\dfs\Applications\Altium\Datasheets\XFMR_MINI-CIRCUITS_TCM2-43X+.pdf; Author: CERN DEM BC; CreateDate: 12.02.2016; LatestRevisionDate: 12.02.2016